# EasyEDA schematic MECB I2C Board.json
TITLE: Sheet_1; REV: 1.0; Date: 2025-10-03; Sheet: 1/1; Drawn By: michael32; Company: Your Company
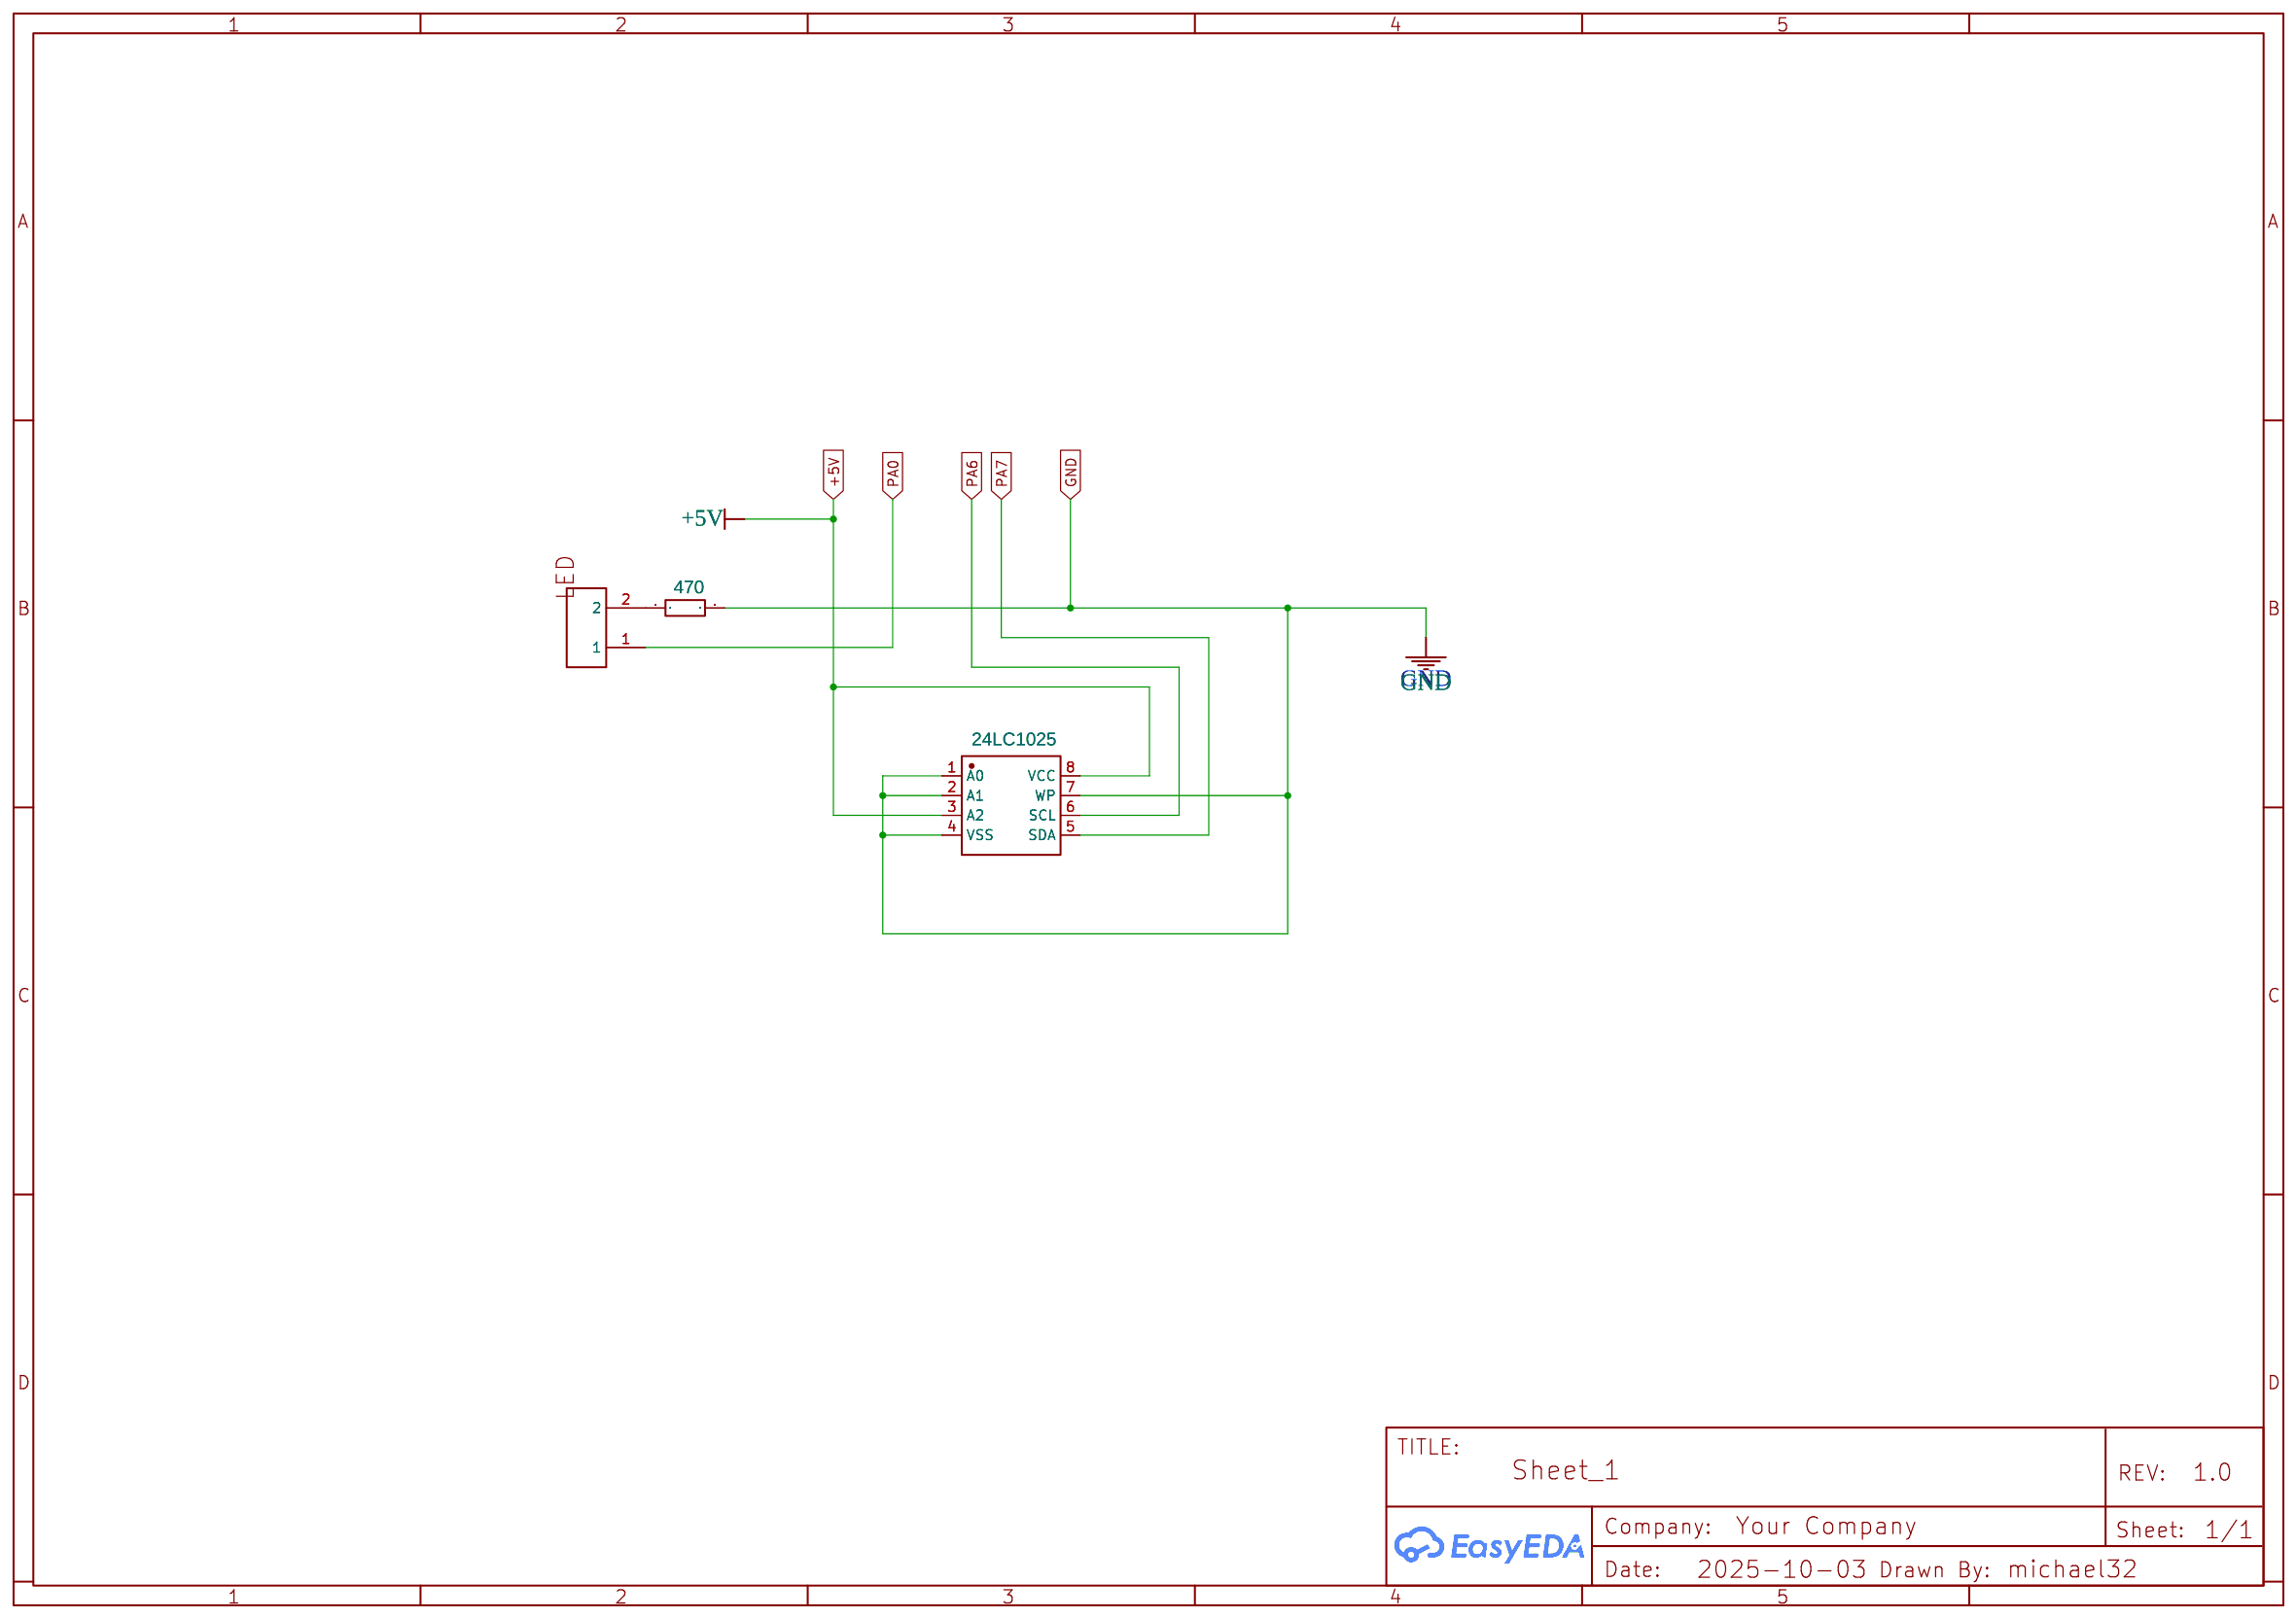
[diagram p0: schematic sheet]

## Parts
R7  470  [RES-TH_BD2.3-L6.5-P6.9-D0.5]
U12  LED  [1X2 FEMALE HEADER]
U13  24LC1025  [DIP-8_L9.7-W6.4-P2.54-LS7.6-BL]

## Library data of the parts
R7 = RES1/4W33R: Supplier: LCSC; Supplier Part: C9900002916; Manufacturer: null; JLCPCB Part Class: Extended Part; link: https://cn.bing.com/search?q=datasheet%3A+%20RES1/4W33R; Contributor: LCSC
U12 = 1x2 female header: Manufacturer: buddhika; Manufacturer Part: YDXX-1X; Supplier Part: 2pin_female_header; Contributor: buddhikakgsl
U13 = 24AA1026-I/P: Contributor: LCSC; Supplier: LCSC; Supplier Part: C613619; Manufacturer: MICROCHIP(美国微芯); JLCPCB Part Class: Extended Part

## Nets
+5V: U13.3(A2) U13.8(VCC)
GND: R7.2 U13.1(A0) U13.2(A1) U13.4(VSS) U13.7(WP)
PA0: U12.1
PA6: U13.6(SCL)
PA7: U13.5(SDA)
Net-(R7-1): R7.1 U12.2

## Notes on the sheet
- GND
